# Altium project Exercise_4.PrjPcb
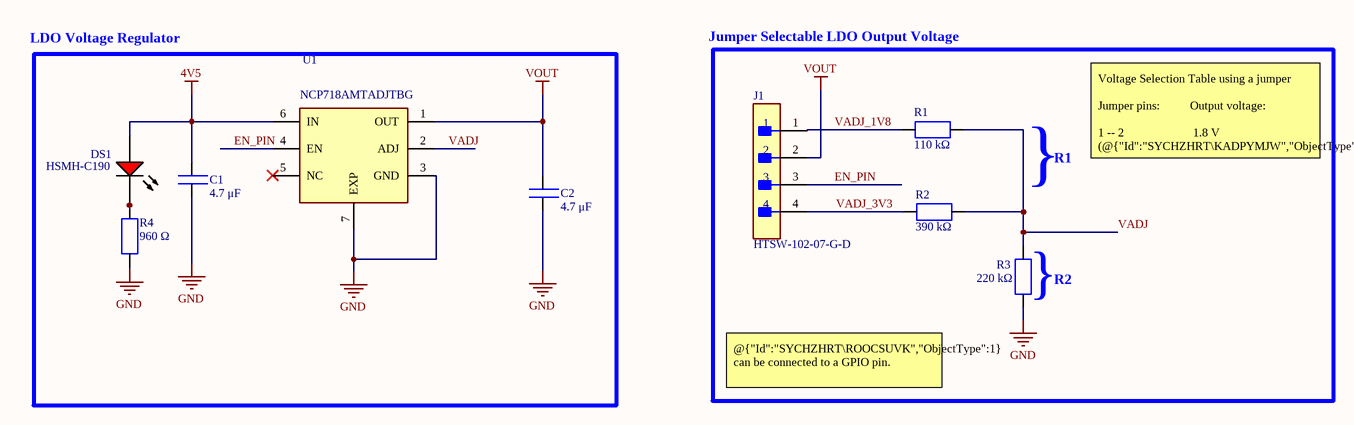
[diagram p0: LDO_Schematic.SchDoc]
2 sheets, 21 parts. Net scope: global (net labels, ports and power ports of the same name join across sheets).
Board files: LDO_PCB.PcbDoc, Buck_PCB.PcbDoc
Sheets:
  LDO_Schematic.SchDoc
  Buck.SchDoc

## Sheet LDO_Schematic.SchDoc: Exercise 4
size A4; DrawnBy: Amal & Carles; DocumentNumber: 1; Revision: 1; SheetNumber: 1; SheetTotal: 1; SheetOf: LDO Voltage Regulator (3V3, 1V8)

### Parts
(Parts that share a designator on the sheet are numbered #1, #2 ... from top to bottom, then left to right.)
C1#1  4.7 μF  [CAP_0201]
C2#1  4.7 μF  [CAP_0201]
DS1  HSMH-C190  [HSMH-C190]
J1#1  HTSW-102-07-G-D  [FP-HTSW-102-07-G-D-MFG]
R1#1  110 kΩ  [RES_0201]
R2#1  390 kΩ  [RES_0201]
R3  220 kΩ  [RES_0201]
R4  960 Ω  [RES_0201]
U1#1  NCP718AMTADJTBG  [NCP718AMTADJTBG]

### Blocks framed on the sheet
LDO Voltage Regulator: C1#1 C2#1 DS1 R4 U1#1
}: J1#1 R1#1 R2#1 R3

### Nets
4V5: C1#1.2 DS1.1(A) U1#1.6(IN)
GND: C1#1.1 C2#1.1 R3.2 R4.2 U1#1.3(GND) U1#1.7(EXP)
VOUT: C2#1.2 J1#1.2 U1#1.1(OUT)
EN_PIN: J1#1.3 U1#1.4(EN)
VADJ: R1#1.1 R2#1.1 R3.1 U1#1.2(ADJ)
VADJ_1V8: J1#1.1 R1#1.2
VADJ_3V3: J1#1.4 R2#1.2
NetDS1_2: DS1.2(K) R4.1

Not connected (* = marked no-connect by the designer): U1#1 5(NC)*

### Notes on the sheet
- Jumper Selectable LDO Output Voltage
- R1
- Voltage Selection Table using a jumper
  Jumper pins:          Output voltage:
  1 -- 2                       1.8 V (@{"Id":"SYCHZHRT\KADPYMJW","ObjectType":1})
  2 -- 3                       3.3 V (@{"Id":"SYCHZHRT\OBUEEYJK","ObjectType":1})
- (near R3) }
- (near R3) R2
- @{"Id":"SYCHZHRT\ROOCSUVK","ObjectType":1}  can be connected to a GPIO pin.

### Library data of the parts
C1#1 = CAP_0201: Capacitor SMD 0201 Generic; Manufacturer: YAGEO; Manufacturer Part Number: CC0201KRX7R7BB103; Capacitance: 10 nF; Tolerance: 10%; LCSC Part Number: C272853
C2#1 = CAP_0201: Capacitor SMD 0201 Generic; Manufacturer: YAGEO; Manufacturer Part Number: CC0201KRX7R7BB103; Tolerance: 10%; LCSC Part Number: C272853; Capacitance: 4.7 μF
DS1 = HSMH-C190: LED Uni-Color Red, 65 mW, 20 mA, -40 to 85 degC, 2-Pin SMD, RoHS, Tape and Reel; Connector Type: USB; Gender: Male; Current Rating: 1 A; Length: 7.5 mm; Lead Pitch: 0.65 mm; PackageReference: HSMX-C190; Package Quantity: 2000; Max Operating Temperature: 85 degC; PackageDescription: 2-Pin Surface Mount Device, Body 1.6 x 0.8 mm, Height 0.9 mm; ComponentLink3Description: Package Specification; Mount: Surface Mount; Min Operating Temperature: -30 degC; ComponentLink3URL: http://www.fairchildsemi.com/dwg/MA/MA03D.pdf; ComponentLink1Description: Manufacturer URL; Contact Material: Copper; Pins: 5; Width: 5.6 mm; ComponentLink2Description: Datasheet; RoHSCompliant: true; DatasheetVersion: Mar-12; Height: 2.8 mm; Packaging: Tape and Reel; Contact Plating: Gold; ComponentLink1URL: http://www.avagotech.com/; REACH SVHC: No SVHC; ComponentLink2URL: http://docs.avagotech.com/docs/AV02-0551EN
J1#1 = CMP-02766-000010-1: CONN HEADER VERT 4POS 2.54MM; Manufacturer: Samtec; Voltage Rating: 550V; Conn Orientation: Straight; Number Of Contacts: 4; Conn Gender: Male; Current Rating: 6.3A; Number Of Rows: 2; Category: Conn; Temperature: -55°C to +125°C; Automotive: No; Digikey Description: CONN HEADER VERT 4POS 2.54MM; ComponentLink2URL: http://suddendocs.samtec.com/catalog_english/htsw_th.pdf; Device Class L2: Headers and Wire Housings; Mouser Description: Conn Unshrouded Header HDR 4 POS 2.54mm Solder ST Thru-Hole Bag; Manufacturer Part Number: HTSW-102-07-G-D; Temperature Range High: +125°C; Contact Material: Gold,Nickel; Temperature Range Low: -55°C; ComponentLink2Description: Datasheet; Device Class L1: Connectors; Pitch: 2.54mm; Octopart: https://octopart.com/htsw-102-07-g-d-samtec-10531767; RoHS: TRUE; Package: HTSW-102-07-G-D; Lead Free: Yes; Device Class L3: unset; Height: 8.71mm
R1#1 = RES_0201: Resistor SMD 0201; Manufacturer: YAGEO; Manufacturer Part Number: RT0201BRD07200RL; Tolerance: 0.1%; Resistance: 110 kOhm; LCSC Part Number: C852221
R2#1 = RES_0201: Resistor SMD 0201 Generic; Manufacturer: YAGEO; Manufacturer Part Number: RT0201BRD07200RL; Tolerance: 0.1%; Resistance: 390 kOhm; LCSC Part Number: C852221
R3 = RES_0201: Resistor SMD 0201 Generic; Manufacturer: YAGEO; Manufacturer Part Number: RT0201BRD07200RL; Tolerance: 0.1%; Resistance: 220 kOhm; LCSC Part Number: C852221
R4 = RES_0201: Resistor SMD 0201 Generic; Manufacturer: YAGEO; Manufacturer Part Number: RT0201BRD07200RL; Tolerance: 0.1%; Resistance: 200 Ohm; LCSC Part Number: C852221
U1#1 = NCP718AMTADJTBG: NCP718AMTADJTBG LDO Regulator, 300 mA, Wide Vin, Ultra-Low Iq Adjustable, Active Discharge, WDFN6; NexarPartId: 87159789; Output Current: 300mA; Number of Outputs: 1; Max Supply Voltage: 24V; Dropout Voltage: 490mV; Nominal Supply Current: 4µA; Min Supply Voltage: 2.5V; Max Junction Temperature (Tj): 150°C; Accuracy: 2%; Max Operating Temperature: 150°C; Output Type: Adjustable; Height: 800µm; RoHS: Compliant; Manufacturer Lifecycle Status: ACTIVE; Number of Channels: 1; Schedule B: 8542390000, 8542390000|8542390000|8542390000|8542390000|8542390000; Lifecycle Status: Production

## Sheet Buck.SchDoc
size A4; SheetNumber: 1; SheetTotal: 1
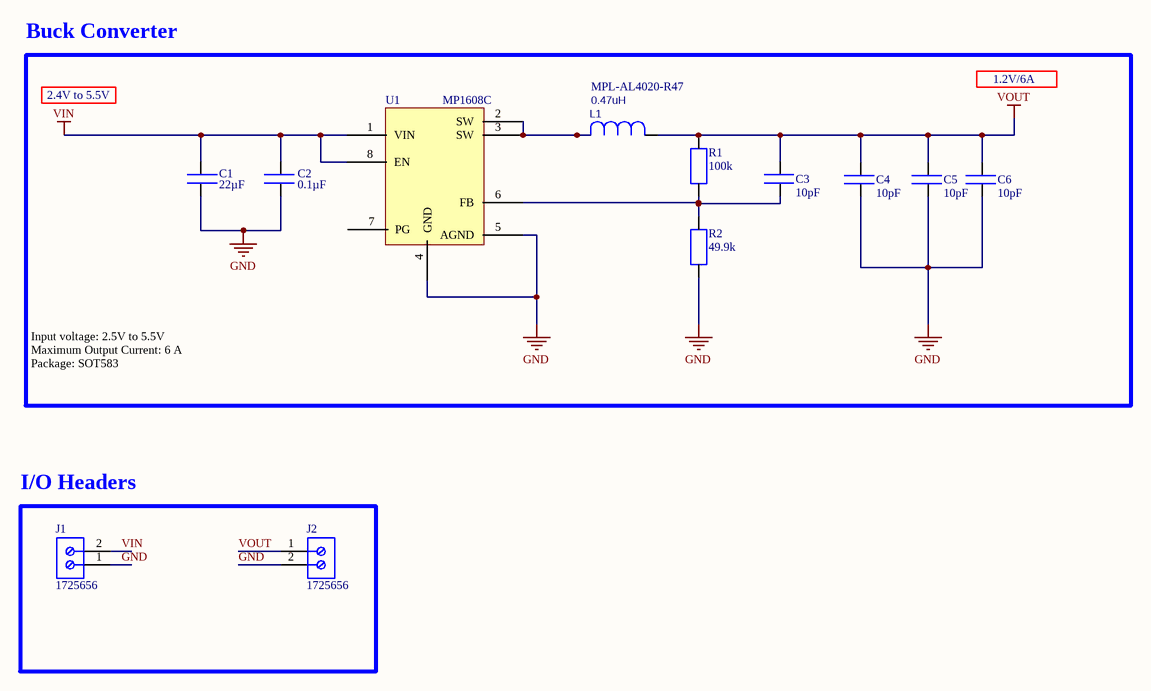
[diagram p1: Buck.SchDoc]

### Parts
(Parts that share a designator on the sheet are numbered #1, #2 ... from top to bottom, then left to right.)
C1#2  22µF  [CAP_0603]
C2#2  0.1µF  [CAP_0603]
C3  10pF  [CAP_0603]
C4  10pF  [CAP_0603]
C5  10pF  [CAP_0603]
C6  10pF  [CAP_0603]
J1#2  1725656  [PHOE-1725656-2]
J2  1725656  [PHOE-1725656-2]
L1  value 0.47uH  [MPL-AL4020-R47]  (hidden comment: COILCRAFT/LPO2506IB-682)
R1#2  100k  [RES_0603]
R2#2  49.9k  [RES_0603]
U1#2  MP1608C  [MP1608C_1]

### Blocks framed on the sheet
Buck Converter: C1#2 C2#2 C3-C6 L1 R1#2 R2#2 U1#2
I/O Headers: J1#2 J2

### Nets
GND: C1#2.1 C2#2.2 C4.2 C5.2 C6.2 J1#2.1 J2.2 R2#2.1 U1#2.4(GND) U1#2.5(AGND)
VIN: C1#2.2 C2#2.1 J1#2.2 U1#2.1(VIN) U1#2.8(EN)
VOUT: C3.1 C4.1 C5.1 C6.1 J2.1 L1.2 R1#2.2
NetC3_2: C3.2 R1#2.1 R2#2.2 U1#2.6(FB)
NetL1_1: L1.1 U1#2.2(SW) U1#2.3(SW)

Not connected (* = marked no-connect by the designer): U1#2 7(PG)

### Notes on the sheet
- 2.4V to 5.5V
- 1.2V/6A
- Input voltage: 2.5V to 5.5V
  Maximum Output Current: 6 A
  Package: SOT583
- (in symbol TOKO106C) MPL-AL4020-R47

### Library data of the parts
C1#2 C2#2 C3-C6 = CAP_0603: Capacitor SMD 0603 Generic; Manufacturer: YAGEO; Manufacturer Part Number: CC0603KRX7R8BB104; Capacitance: 100 nF; Tolerance: 10%; LCSC Part Number: C92490
J1#2 J2 = CMP-2000-05299-1: Male Header, Pitch 2.54 mm, 1 x 2 Position, Height 9 mm, Tail Length 3.5 mm; Manufacturer: Phoenix Contact; Number of contacts: 2; Content: 250pc(s); Pitch: 2.54mm; Industrial packaging: Yes; Colour: Green; Manufacturer part No.: 1725656; Type: MPT0,5/2-2,54; Datasheet URL: http://datasheet.octopart.com/1725656-Phoenix-Contact-datasheet-5302866.pdf; Manufacturer URL: http://www.phoenixcontact.com/; Datasheet Version: Apr-08
L1 = TOKO106C
R1#2 R2#2 = RES_0603: Resistor SMD 0603 Generic; Manufacturer: YAGEO; Manufacturer Part Number: NT0603BRD0711K1L; Tolerance: 0.1%; Resistance: 11.1 kOhm; LCSC Part Number: C5197511
U1#2 = MP1608C: The MP1608C is a monolithic, step-down switchmode converter with built-in internal power / MOSFETs. It achieves 6A of continuous output / current (IOUT) from a 2.4V to 5.5V input voltage / (VIN) range, with excellent load and line / regulation. The output voltage (VOUT) can be / regulated to as low as 0.4V. / The constant-on-time (COT) control scheme / provides fast transient response and facilitates / loop stabilization. Fault protections include / cycle-by-cycle current limiting and thermal / shutdown. / The MP1608C is well-suited for a wide range of / applications including high-performance digital / signal processors (DSPs), wireless power, / portable and mobile devices, and other lowpower systems. / The MP1608C requires a minimal number of / readily available, standard external components. / It is available in an ultra-small SOT583 package.; Manufacturer: Monolithic Power Systems (MPS); Manufacturer Part Number: MP1608CGTL-P; Switching Frequency: 1.25MHz; Operating Junction Temp (Tj): -40°C to +125°C; Feedback Voltage (Vfb): 0.6V; Input Voltage (Min): 2.4V; Input Voltage (Max): 5.5V; Output Current (Max): 6A; Package: SOT583-8; Mounting Type: Surface Mount (SMD)

## Nets that join several sheets
GND: LDO_Schematic (6 pins), Buck (10 pins)
VOUT: LDO_Schematic (C2#1.2 J1#1.2 U1#1.1), Buck (7 pins)